# Altium schematic sheet C40_IMB_Block_Diagram_2.SchDoc: C40 IMB BLOCK DIAGRAM 2
size 812 x 571 mm; DocumentNumber: 3; SheetNumber: 2; SheetTotal: 7; PageSetup: Record=PageOptions|CenterHorizontal=True|CenterVertical=True|PrintScale=0.48|XCorrection=1.00|YCorrection=1.00|PrintKind=0|BorderSize=5000000|LeftOffset=0|BottomOffset=0|Orientation=2|PaperLength=1000|PaperWidth=1000|Scale=100|PaperSource=15|PrintQuality=1200|MediaType=1|DitherType=10|PaperKind=11 x 17|PrintScaleMode=1
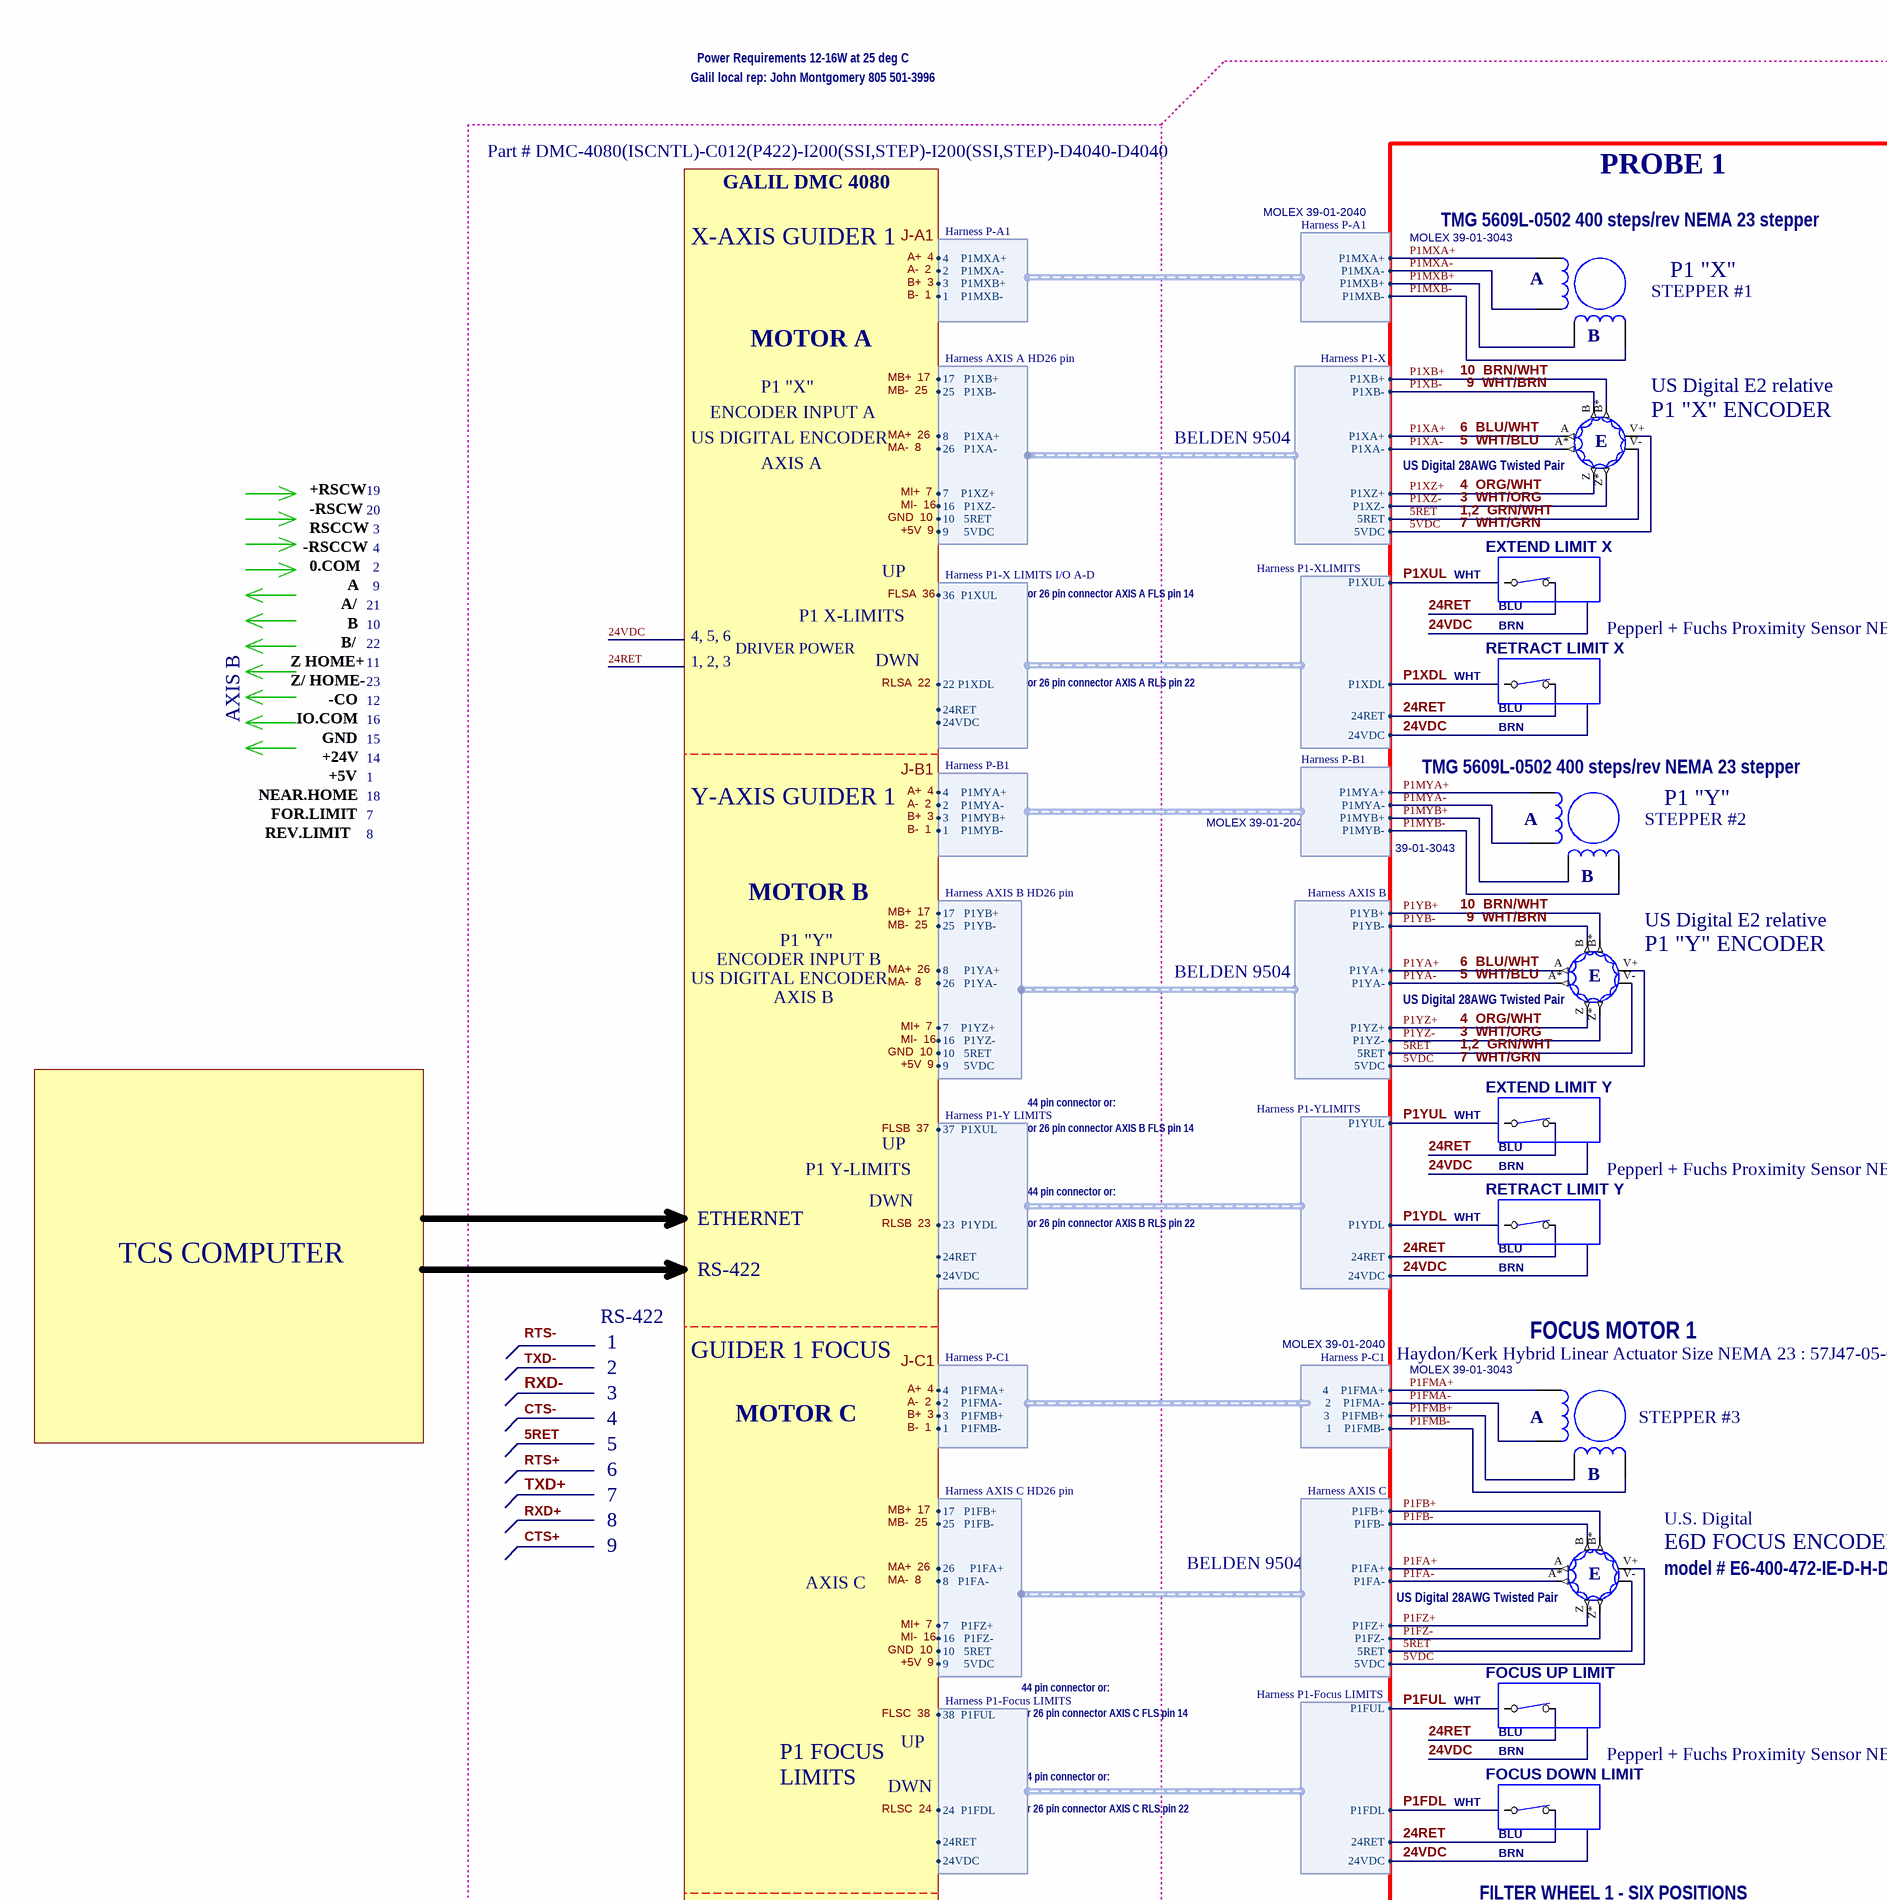
[diagram p0: C40_IMB_Block_Diagram_2.SchDoc, top left]
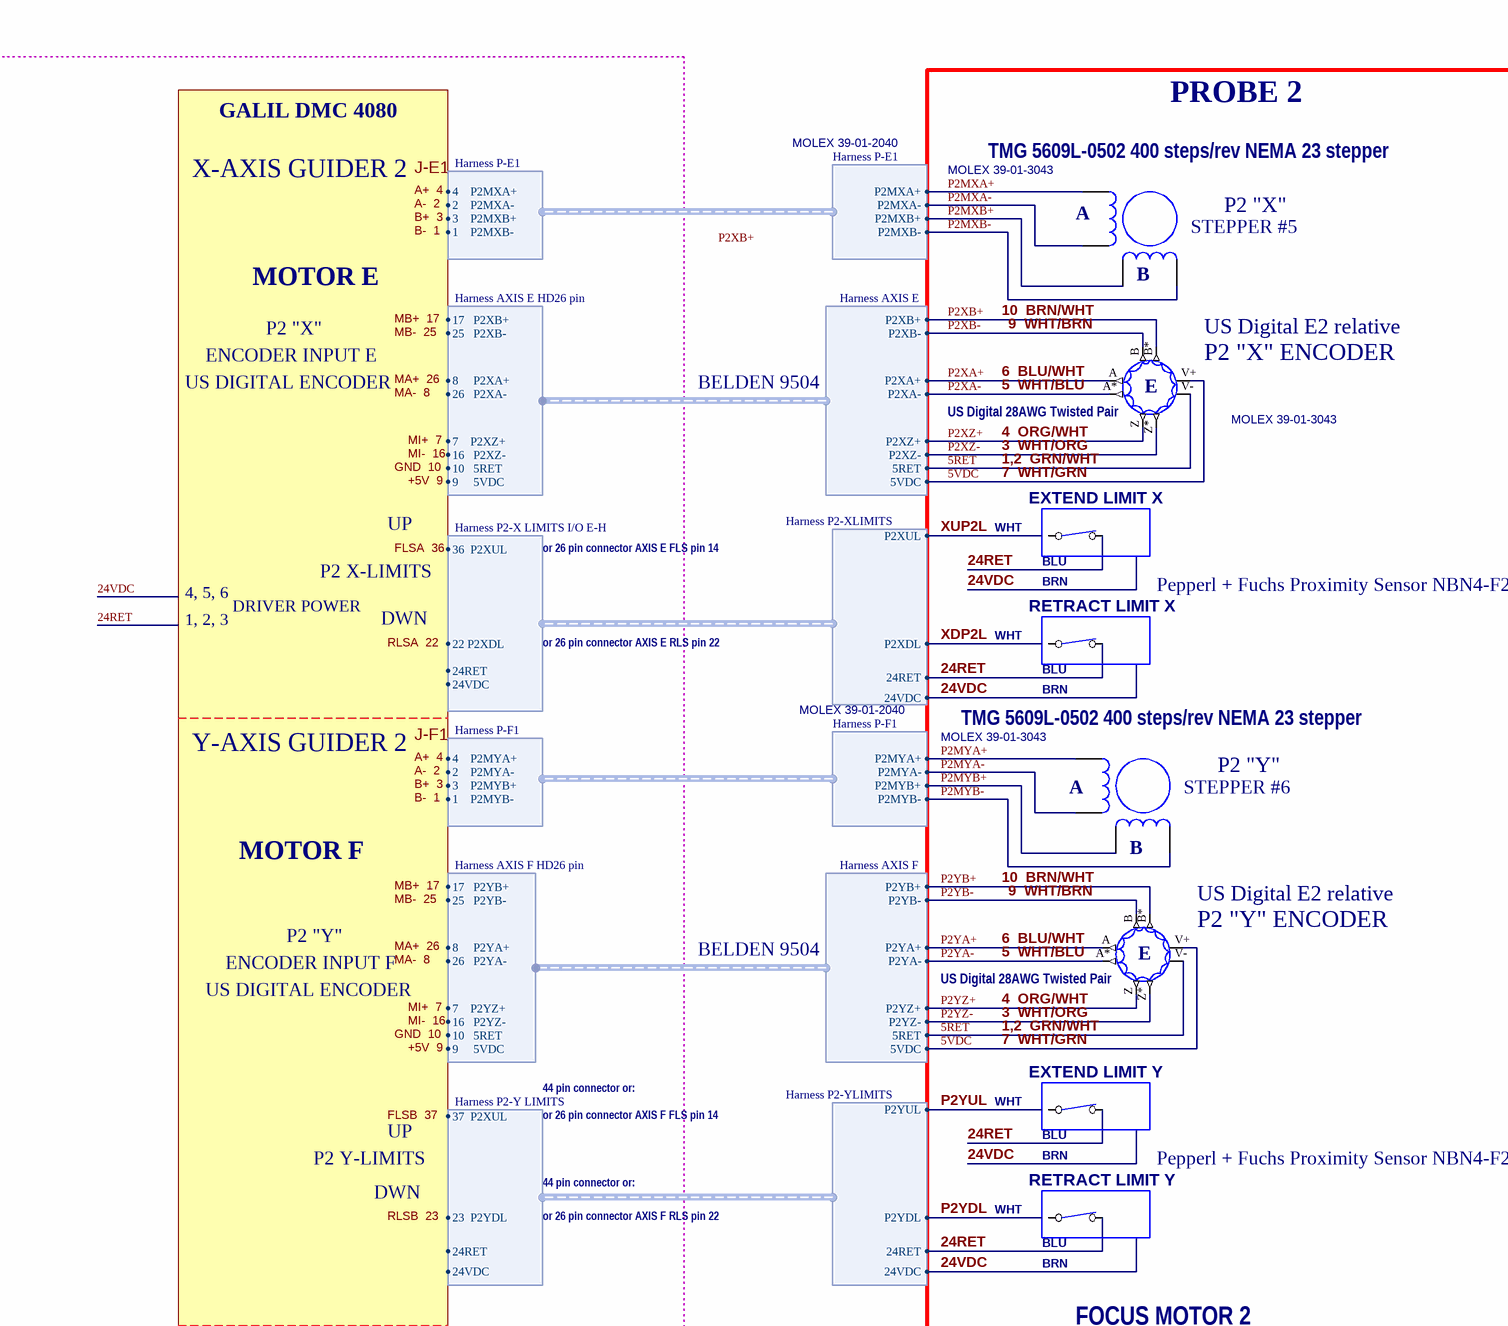
[diagram p1: C40_IMB_Block_Diagram_2.SchDoc, top middle]
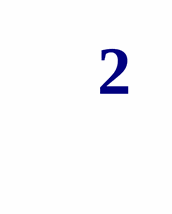
[diagram p2: C40_IMB_Block_Diagram_2.SchDoc, top right]
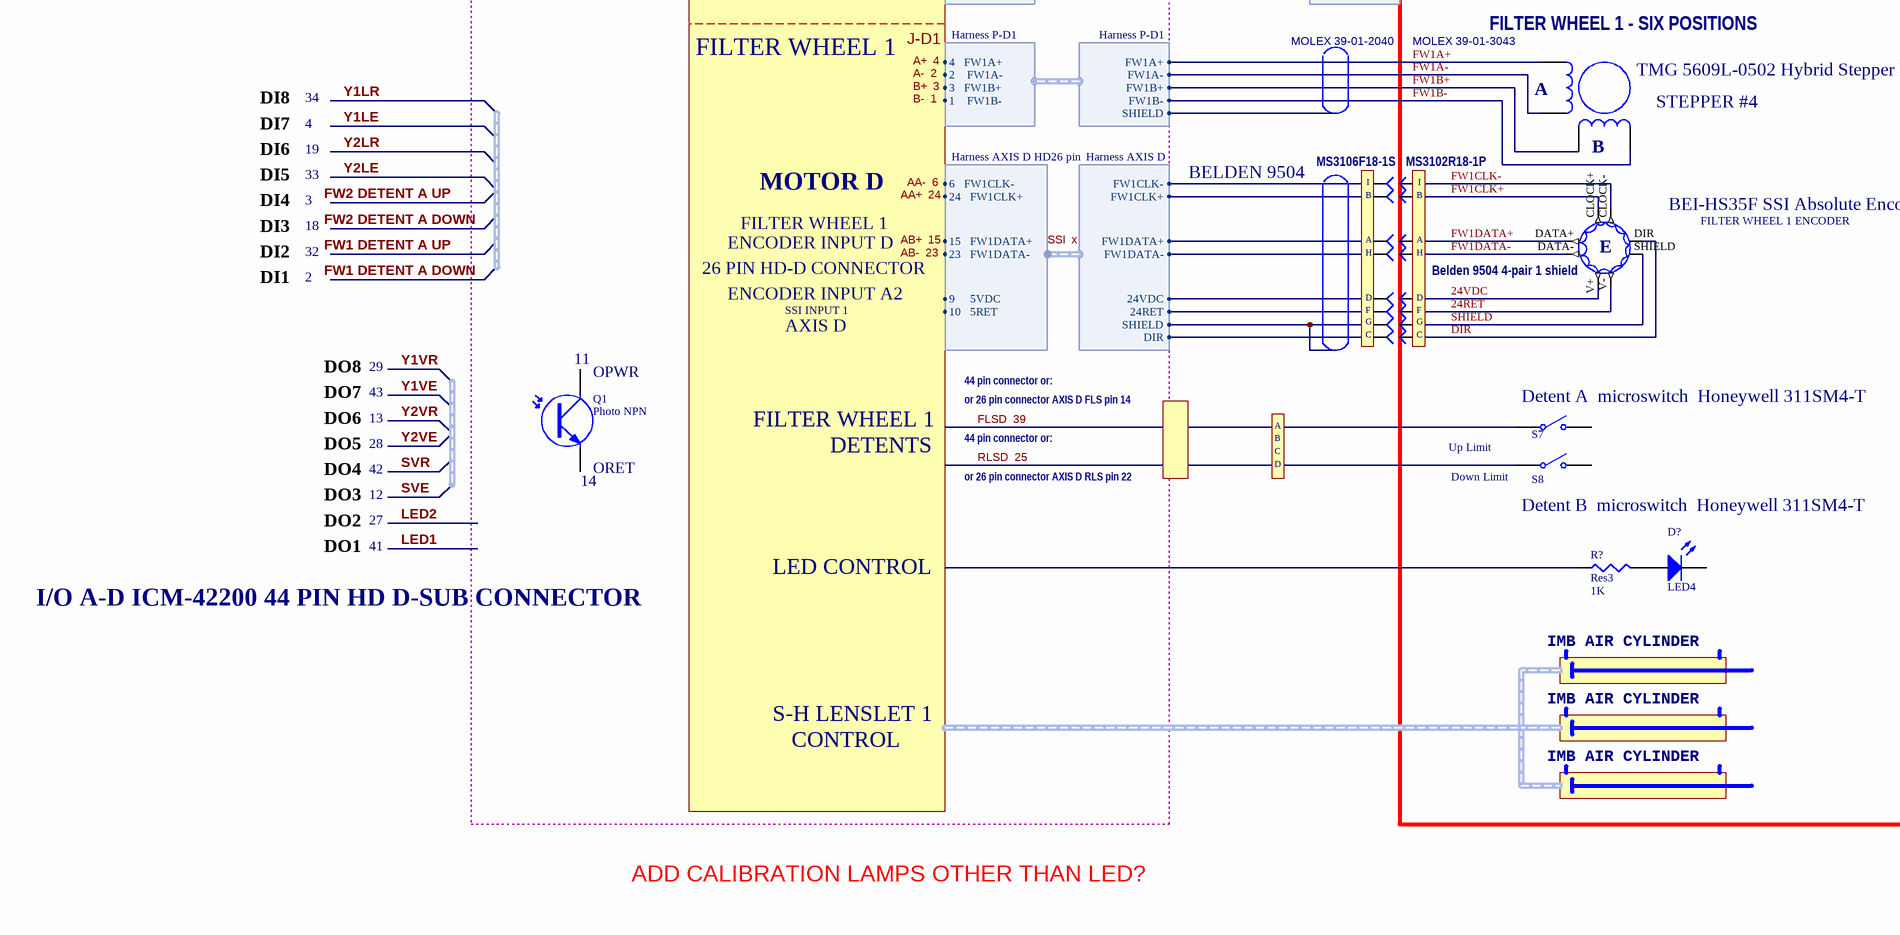
[diagram p3: C40_IMB_Block_Diagram_2.SchDoc, bottom left]
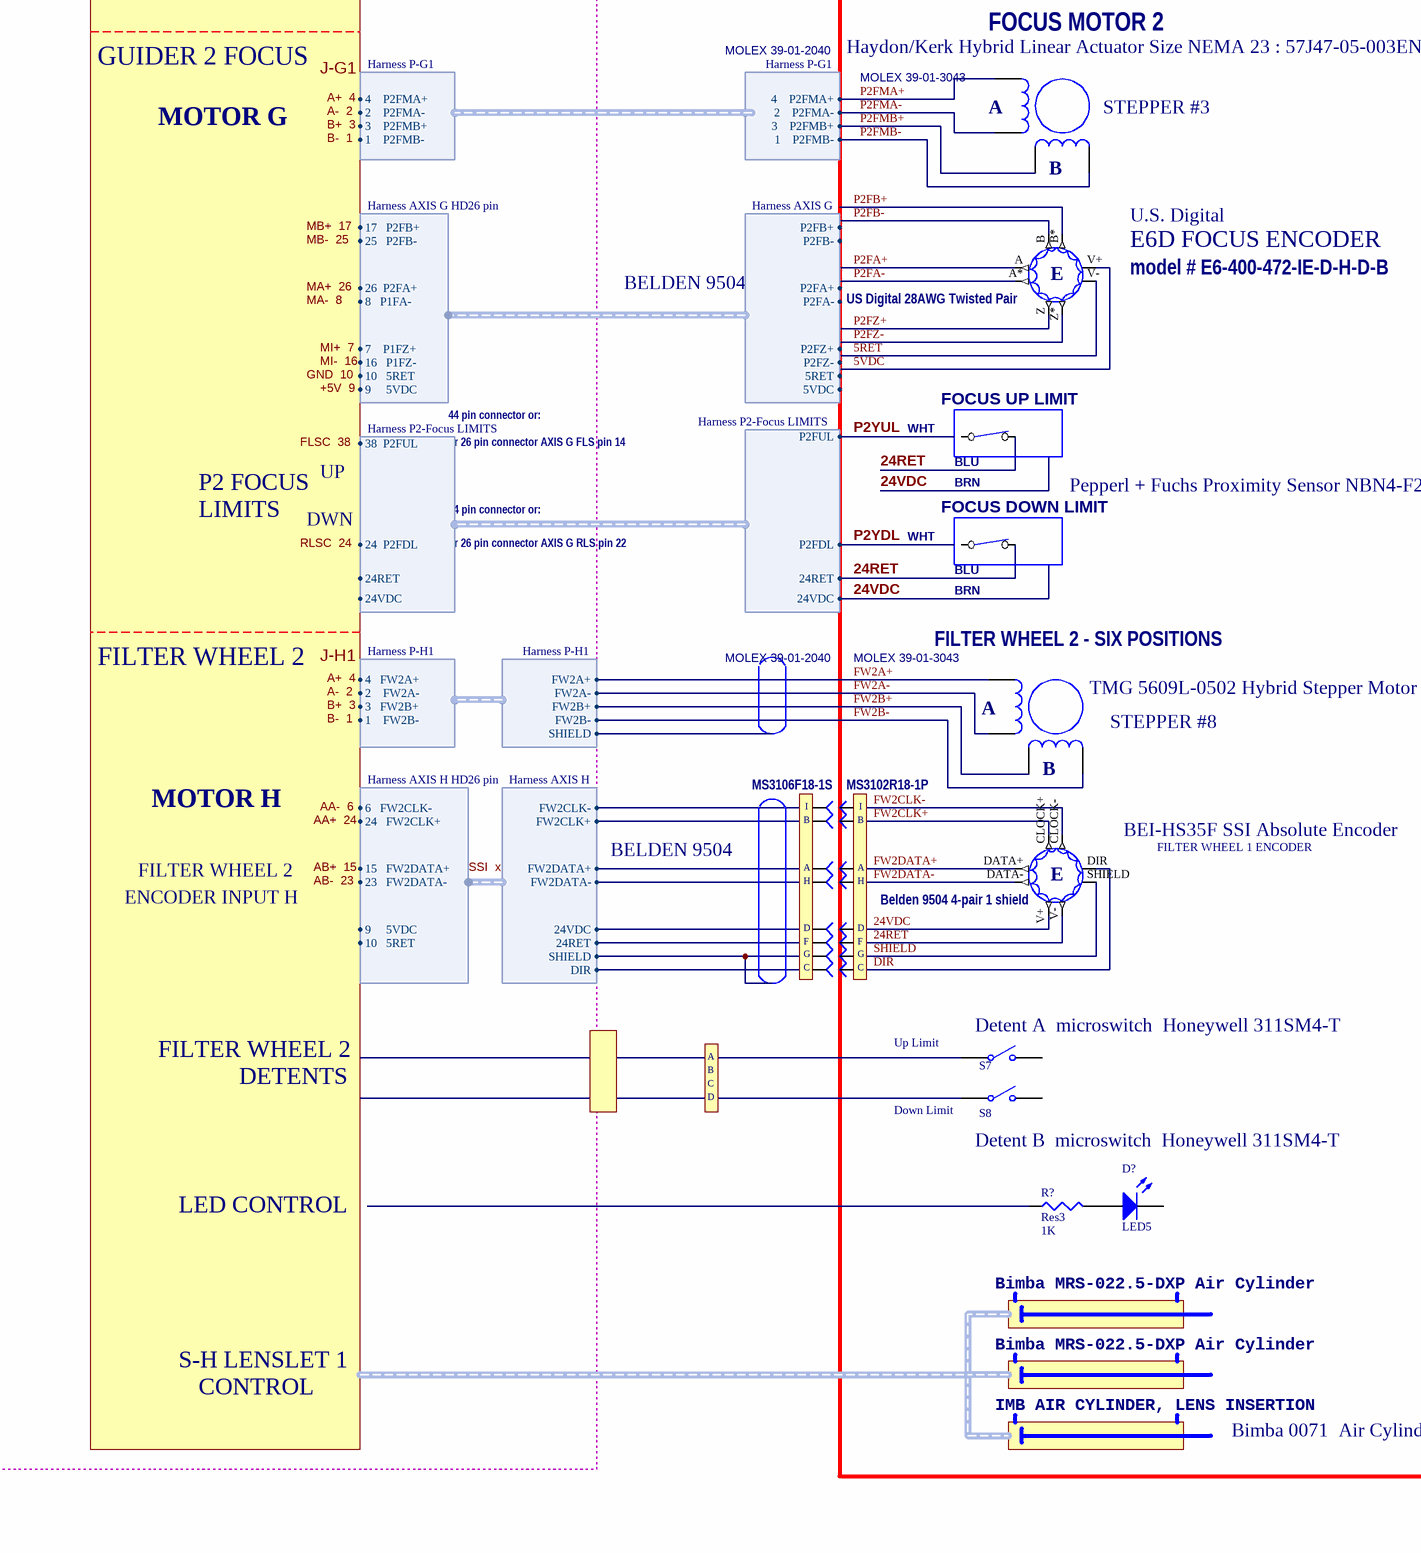
[diagram p4: C40_IMB_Block_Diagram_2.SchDoc, bottom middle]
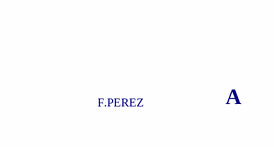
[diagram p5: C40_IMB_Block_Diagram_2.SchDoc, bottom right]

## Parts
(Parts that share a designator on the sheet are numbered #1, #2 ... from top to bottom, then left to right.)
?#1  SW-NC2  (value not drawn)
?#2  SW-NC2  (value not drawn)
?#3  SW-NC2  (value not drawn)
?#4  SW-NC2  (value not drawn)
?#5  SW-NC2  (value not drawn)
?#6  SW-NC2  (value not drawn)
?#7  SW-NC2  (value not drawn)
?#8  SW-NC2  (value not drawn)
?#9  SW-NC2  (value not drawn)
?#10  SW-NC2  (value not drawn)
?#11  SW-NC2  (value not drawn)
?#12  SW-NC2  (value not drawn)
?#13  (no value)
?#14  (no value)
?#15  (no value)
?#16  (no value)
?#17  (no value)
?#18  (no value)
?#19  (no value)
?#20  (no value)
?#21  (no value)
?#22  (no value)
?#23  (no value)
?#24  (no value)
?#25  (no value)
?#26  (no value)
?#27  (no value)
?#28  (no value)
B#1  (no value)
B#2  (no value)
B#3  (no value)
B#4  (no value)
B#5  (no value)
B#6  (no value)
B#7  (no value)
B#8  (no value)
B#9  (no value)
B#10  (no value)
B#11  (no value)
B#12  (no value)
B#13  (no value)
B#14  (no value)
B#15  (no value)
B#16  (no value)
BEI-HS35F_SSI_Absolute_Encoder#1  FILTER WHEEL 1 ENCODER
BEI-HS35F_SSI_Absolute_Encoder#2  FILTER WHEEL 1 ENCODER
Bimba_MRS-022.5-DXP_Air_Cylinder#1  (no value)
Bimba_MRS-022.5-DXP_Air_Cylinder#2  (no value)
D?#1  LED4  [LED-1]
D?#2  LED5  [LED-1]
Haydon/Kerk_Hybrid_Linear_Actuator_Size_NEMA_23_:_57J47-05-003ENG#1  STEPPER #3
Haydon/Kerk_Hybrid_Linear_Actuator_Size_NEMA_23_:_57J47-05-003ENG#2  STEPPER #3
IMB_AIR_CYLINDER#1  (no value)
IMB_AIR_CYLINDER#2  (no value)
IMB_AIR_CYLINDER#3  (no value)
IMB_AIR_CYLINDER,_LENS_INSERTION  (no value)
P1_"X"  STEPPER #1
P1_"Y"  STEPPER #2
P2_"X"  STEPPER #5
P2_"Y"  STEPPER #6
Q1  Photo NPN  [SFM-T2(3)/X1.6V]
R?#1  Res3  value 1K  [J1-0603]
R?#2  Res3  value 1K  [J1-0603]
S7#1  Up Limit  [SPST-2]
S7#2  Up Limit  [SPST-2]
S8#1  Down Limit  [SPST-2]
S8#2  Down Limit  [SPST-2]
TMG_5609L-0502_Hybrid_Stepper_Motor#1  STEPPER #4
TMG_5609L-0502_Hybrid_Stepper_Motor#2  STEPPER #8
U.S._Digital#1  E6D FOCUS ENCODER
U.S._Digital#2  E6D FOCUS ENCODER
US_Digital_E2_relative#1  P1 "X" ENCODER
US_Digital_E2_relative#2  P2 "X" ENCODER
US_Digital_E2_relative#3  P1 "Y" ENCODER
US_Digital_E2_relative#4  P2 "Y" ENCODER

## Blocks framed on the sheet
PROBE 1: ?#1 ?#3 ?#5 ?#7 ?#9 ?#11 B#1 B#3 B#5 B#7 B#9 B#11 B#13 B#15 BEI-HS35F_SSI_Absolute_Encoder#1 D?#1 Haydon/Kerk_Hybrid_Linear_Actuator_Size_NEMA_23_:_57J47-05-003ENG#2 IMB_AIR_CYLINDER#1-IMB_AIR_CYLINDER#3 P1_"X" P1_"Y" R?#1 S7#1 S8#1 TMG_5609L-0502_Hybrid_Stepper_Motor#1 U.S._Digital#2 US_Digital_E2_relative#1 US_Digital_E2_relative#3
PROBE 2: ?#2 ?#4 ?#6 ?#8 ?#10 ?#12 B#2 B#4 B#6 B#8 B#10 B#12 B#14 B#16 BEI-HS35F_SSI_Absolute_Encoder#2 Bimba_MRS-022.5-DXP_Air_Cylinder#1 Bimba_MRS-022.5-DXP_Air_Cylinder#2 D?#2 Haydon/Kerk_Hybrid_Linear_Actuator_Size_NEMA_23_:_57J47-05-003ENG#1 IMB_AIR_CYLINDER,_LENS_INSERTION P2_"X" P2_"Y" R?#2 S7#2 S8#2 TMG_5609L-0502_Hybrid_Stepper_Motor#2 U.S._Digital#1 US_Digital_E2_relative#2 US_Digital_E2_relative#4

## Harnesses
Harness P1-X: P1XB+, P1XB-, P1XA+, P1XA-, P1XZ+, P1XZ-, 5RET, 5VDC
Harness AXIS D: FW1CLK-, FW1CLK+, FW1DATA+, FW1DATA-, 24VDC, 24RET, SHIELD, DIR
Harness AXIS A HD26 pin: 17   P1XB+, 25   P1XB-, 8     P1XA+, 26   P1XA-, 7    P1XZ+, 16   P1XZ-, 10   5RET, 9     5VDC
Harness AXIS B: P1YB+, P1YB-, P1YA+, P1YA-, P1YZ+, P1YZ-, 5RET, 5VDC
Harness AXIS B HD26 pin: 17   P1YB+, 25   P1YB-, 8     P1YA+, 26   P1YA-, 7    P1YZ+, 16   P1YZ-, 10   5RET, 9     5VDC
Harness AXIS C: P1FB+, P1FB-, P1FA+, P1FA-, P1FZ+, P1FZ-, 5RET, 5VDC
Harness AXIS C HD26 pin: 17   P1FB+, 25   P1FB-, 26     P1FA+, 8   P1FA-, 7    P1FZ+, 16   P1FZ-, 10   5RET, 9     5VDC
Harness P1-XLIMITS: P1XUL, 24RET, 24VDC, P1XDL
Harness P1-X LIMITS I/O A-D: 36  P1XUL, 24RET, 24VDC, 22 P1XDL
Harness P1-YLIMITS: P1YUL, 24RET, 24VDC, P1YDL
Harness P1-Y LIMITS: 37  P1XUL, 24RET, 24VDC, 23  P1YDL
Harness P1-Focus LIMITS: P1FUL, 24RET, 24VDC, P1FDL
Harness P1-Focus LIMITS: 38  P1FUL, 24RET, 24VDC, 24  P1FDL
Harness AXIS D HD26 pin: 10   5RET, 9     5VDC, 6   FW1CLK-, 24   FW1CLK+, 15   FW1DATA+, 23   FW1DATA-
Harness P-C1: 4    P1FMA+, 2    P1FMA-, 3    P1FMB+, 1    P1FMB-
Harness P-B1: 4    P1MYA+, 2    P1MYA-, 3    P1MYB+, 1    P1MYB-
Harness P-B1: P1MYA+, P1MYA-, P1MYB+, P1MYB-
Harness P-A1: 4    P1MXA+, 2    P1MXA-, 3    P1MXB+, 1    P1MXB-
Harness P-A1: P1MXA+, P1MXA-, P1MXB+, P1MXB-
Harness P-D1: 4   FW1A+, 2    FW1A-, 3   FW1B+, 1    FW1B-
Harness P-D1: FW1A+, FW1A-, FW1B+, FW1B-, SHIELD
Harness AXIS E: P2XB+, P2XB-, P2XA+, P2XA-, P2XZ+, P2XZ-, 5RET, 5VDC
Harness AXIS E HD26 pin: 17   P2XB+, 25   P2XB-, 8     P2XA+, 26   P2XA-, 7    P2XZ+, 16   P2XZ-, 10   5RET, 9     5VDC
Harness AXIS F: P2YB+, P2YB-, P2YA+, P2YA-, P2YZ+, P2YZ-, 5RET, 5VDC
Harness AXIS F HD26 pin: 17   P2YB+, 25   P2YB-, 8     P2YA+, 26   P2YA-, 7    P2YZ+, 16   P2YZ-, 10   5RET, 9     5VDC
Harness AXIS G: P2FB+, P2FB-, P2FA+, P2FA-, P2FZ+, P2FZ-, 5RET, 5VDC
Harness AXIS G HD26 pin: 17   P2FB+, 25   P2FB-, 26  P2FA+, 8   P1FA-, 7    P1FZ+, 16   P1FZ-, 10   5RET, 9     5VDC
Harness P2-XLIMITS: P2XUL, 24RET, 24VDC, P2XDL
Harness P2-X LIMITS I/O E-H: 36  P2XUL, 24RET, 24VDC, 22 P2XDL
Harness P2-YLIMITS: P2YUL, 24RET, 24VDC, P2YDL
Harness P2-Y LIMITS: 37  P2XUL, 24RET, 24VDC, 23  P2YDL
Harness P2-Focus LIMITS: P2FUL, 24RET, 24VDC, P2FDL
Harness P2-Focus LIMITS: 38  P2FUL, 24RET, 24VDC, 24  P2FDL
Harness P-G1: 4    P2FMA+, 2    P2FMA-, 3    P2FMB+, 1    P2FMB-
Harness P-F1: 4    P2MYA+, 2    P2MYA-, 3    P2MYB+, 1    P2MYB-
Harness P-F1: P2MYA+, P2MYA-, P2MYB+, P2MYB-
Harness P-E1: 4    P2MXA+, 2    P2MXA-, 3    P2MXB+, 1    P2MXB-
Harness P-E1: P2MXA+, P2MXA-, P2MXB+, P2MXB-
Harness AXIS H: FW2CLK-, FW2CLK+, FW2DATA+, FW2DATA-, 24VDC, 24RET, SHIELD, DIR
Harness AXIS H HD26 pin: 10   5RET, 9     5VDC, 6   FW2CLK-, 24   FW2CLK+, 15   FW2DATA+, 23   FW2DATA-
Harness P-H1: 4   FW2A+, 2    FW2A-, 3   FW2B+, 1    FW2B-
Harness P-H1: FW2A+, FW2A-, FW2B+, FW2B-, SHIELD

## Nets
1,2  GRN/WHT: U.S._Digital#1.V- U.S._Digital#2.V- US_Digital_E2_relative#1.V- US_Digital_E2_relative#2.V- US_Digital_E2_relative#3.V- US_Digital_E2_relative#4.V- ; harness Harness P1-X.5RET, harness Harness AXIS B.5RET, harness Harness AXIS C.5RET, harness Harness AXIS E.5RET, harness Harness AXIS F.5RET  [also labelled 5RET]
3  WHT/ORG: US_Digital_E2_relative#1.Z* US_Digital_E2_relative#2.Z* US_Digital_E2_relative#3.Z* US_Digital_E2_relative#4.Z* ; harness Harness P1-X.P1XZ-, harness Harness AXIS B.P1YZ-, harness Harness AXIS E.P2XZ-, harness Harness AXIS F.P2YZ-  [also labelled P1XZ-, P1YZ-, P2XZ-, P2YZ-]
4  ORG/WHT: US_Digital_E2_relative#1.Z US_Digital_E2_relative#2.Z US_Digital_E2_relative#3.Z US_Digital_E2_relative#4.Z ; harness Harness P1-X.P1XZ+, harness Harness AXIS B.P1YZ+, harness Harness AXIS E.P2XZ+, harness Harness AXIS F.P2YZ+  [also labelled P1XZ+, P1YZ+, P2XZ+, P2YZ+]
5  WHT/BLU: US_Digital_E2_relative#1.A* US_Digital_E2_relative#2.A* US_Digital_E2_relative#3.A* US_Digital_E2_relative#4.A* ; harness Harness P1-X.P1XA-, harness Harness AXIS B.P1YA-, harness Harness AXIS E.P2XA-, harness Harness AXIS F.P2YA-  [also labelled P1XA-, P1YA-, P2XA-, P2YA-]
5VDC: U.S._Digital#1.V+ U.S._Digital#2.V+ US_Digital_E2_relative#1.V+ US_Digital_E2_relative#2.V+ US_Digital_E2_relative#3.V+ US_Digital_E2_relative#4.V+ ; harness Harness P1-X.5VDC, harness Harness AXIS B.5VDC, harness Harness AXIS C.5VDC, harness Harness AXIS E.5VDC, harness Harness AXIS F.5VDC  [also labelled 7  WHT/GRN]
6  BLU/WHT: US_Digital_E2_relative#1.A US_Digital_E2_relative#2.A US_Digital_E2_relative#3.A US_Digital_E2_relative#4.A ; harness Harness P1-X.P1XA+, harness Harness AXIS B.P1YA+, harness Harness AXIS E.P2XA+, harness Harness AXIS F.P2YA+  [also labelled P1XA+, P1YA+, P2XA+, P2YA+]
9  WHT/BRN: US_Digital_E2_relative#1.B US_Digital_E2_relative#2.B US_Digital_E2_relative#3.B US_Digital_E2_relative#4.B ; harness Harness P1-X.P1XB-, harness Harness AXIS B.P1YB-, harness Harness AXIS E.P2XB-, harness Harness AXIS F.P2YB-  [also labelled P1XB-, P1YB-, P2XB-, P2YB-]
10  BRN/WHT: US_Digital_E2_relative#1.B* US_Digital_E2_relative#2.B* US_Digital_E2_relative#3.B* US_Digital_E2_relative#4.B* ; harness Harness P1-X.P1XB+, harness Harness AXIS B.P1YB+, harness Harness AXIS E.P2XB+, harness Harness AXIS F.P2YB+  [also labelled P1XB+, P1YB+, P2XB+, P2YB+]
24RET: ?#1.2 ?#2.2 ?#3.2 ?#4.2 ?#5.2 ?#6.2 ?#7.2 ?#8.2 ?#9.2 ?#10.2 ?#11.2 ?#12.2 B#11.?1 B#12.?1 BEI-HS35F_SSI_Absolute_Encoder#1.V- BEI-HS35F_SSI_Absolute_Encoder#2.V- ; harness Harness P1-XLIMITS.24RET, harness Harness P1-X LIMITS I/O A-D.24RET, harness Harness P1-YLIMITS.24RET, harness Harness P1-Y LIMITS.24RET, harness Harness P1-Focus LIMITS.24RET, harness Harness P2-XLIMITS.24RET, harness Harness P2-X LIMITS I/O E-H.24RET, harness Harness P2-YLIMITS.24RET, harness Harness P2-Y LIMITS.24RET, harness Harness P2-Focus LIMITS.24RET
24VDC: B#9.?1 B#10.?1 BEI-HS35F_SSI_Absolute_Encoder#1.V+ BEI-HS35F_SSI_Absolute_Encoder#2.V+ ; harness Harness P1-XLIMITS.24VDC, harness Harness P1-X LIMITS I/O A-D.24VDC, harness Harness P1-YLIMITS.24VDC, harness Harness P1-Y LIMITS.24VDC, harness Harness P1-Focus LIMITS.24VDC, harness Harness P2-XLIMITS.24VDC, harness Harness P2-X LIMITS I/O E-H.24VDC, harness Harness P2-YLIMITS.24VDC, harness Harness P2-Y LIMITS.24VDC, harness Harness P2-Focus LIMITS.24VDC
DIR: B#15.?1 B#16.?1 BEI-HS35F_SSI_Absolute_Encoder#1.DIR BEI-HS35F_SSI_Absolute_Encoder#2.DIR
FLSD  39: S7#1.1(COMMON)
FW1A+: TMG_5609L-0502_Hybrid_Stepper_Motor#1.1 ; harness Harness P-D1.FW1A+
FW1A-: TMG_5609L-0502_Hybrid_Stepper_Motor#1.3 ; harness Harness P-D1.FW1A-
FW1B+: TMG_5609L-0502_Hybrid_Stepper_Motor#1.4 ; harness Harness P-D1.FW1B+
FW1B-: TMG_5609L-0502_Hybrid_Stepper_Motor#1.6 ; harness Harness P-D1.FW1B-
FW1CLK+: B#3.?1 BEI-HS35F_SSI_Absolute_Encoder#1.CLOCK+
FW1CLK-: BEI-HS35F_SSI_Absolute_Encoder#1.CLOCK-
FW1DATA+: B#5.?1 BEI-HS35F_SSI_Absolute_Encoder#1.DATA+
FW1DATA-: B#7.?1 BEI-HS35F_SSI_Absolute_Encoder#1.DATA-
FW2A+: TMG_5609L-0502_Hybrid_Stepper_Motor#2.1 ; harness Harness P-H1.FW2A+
FW2A-: TMG_5609L-0502_Hybrid_Stepper_Motor#2.3 ; harness Harness P-H1.FW2A-
FW2B+: TMG_5609L-0502_Hybrid_Stepper_Motor#2.4 ; harness Harness P-H1.FW2B+
FW2B-: TMG_5609L-0502_Hybrid_Stepper_Motor#2.6 ; harness Harness P-H1.FW2B-
FW2CLK+: B#4.?1 BEI-HS35F_SSI_Absolute_Encoder#2.CLOCK+
FW2CLK-: BEI-HS35F_SSI_Absolute_Encoder#2.CLOCK-
FW2DATA+: B#6.?1 BEI-HS35F_SSI_Absolute_Encoder#2.DATA+
FW2DATA-: B#8.?1 BEI-HS35F_SSI_Absolute_Encoder#2.DATA-
P1FA+: U.S._Digital#2.A ; harness Harness AXIS C.P1FA+
P1FA-: U.S._Digital#2.A* ; harness Harness AXIS C.P1FA-
P1FB+: U.S._Digital#2.B* ; harness Harness AXIS C.P1FB+
P1FB-: U.S._Digital#2.B ; harness Harness AXIS C.P1FB-
P1FDL: harness Harness P1-Focus LIMITS.P1FDL
P1FMA+: Haydon/Kerk_Hybrid_Linear_Actuator_Size_NEMA_23_:_57J47-05-003ENG#2.1 ; harness Harness P-C1.4    P1FMA+
P1FMA-: Haydon/Kerk_Hybrid_Linear_Actuator_Size_NEMA_23_:_57J47-05-003ENG#2.3 ; harness Harness P-C1.2    P1FMA-
P1FMB+: Haydon/Kerk_Hybrid_Linear_Actuator_Size_NEMA_23_:_57J47-05-003ENG#2.4 ; harness Harness P-C1.3    P1FMB+
P1FMB-: Haydon/Kerk_Hybrid_Linear_Actuator_Size_NEMA_23_:_57J47-05-003ENG#2.6 ; harness Harness P-C1.1    P1FMB-
P1FUL: harness Harness P1-Focus LIMITS.P1FUL
P1FZ+: U.S._Digital#2.Z ; harness Harness AXIS C.P1FZ+
P1FZ-: U.S._Digital#2.Z* ; harness Harness AXIS C.P1FZ-
P1MXA+: P1_"X".1 ; harness Harness P-A1.P1MXA+
P1MXA-: P1_"X".3 ; harness Harness P-A1.P1MXA-
P1MXB+: P1_"X".4 ; harness Harness P-A1.P1MXB+
P1MXB-: P1_"X".6 ; harness Harness P-A1.P1MXB-
P1MYA+: P1_"Y".1 ; harness Harness P-B1.P1MYA+
P1MYA-: P1_"Y".3 ; harness Harness P-B1.P1MYA-
P1MYB+: P1_"Y".4 ; harness Harness P-B1.P1MYB+
P1MYB-: P1_"Y".6 ; harness Harness P-B1.P1MYB-
P1XDL: harness Harness P1-XLIMITS.P1XDL
P1XUL: harness Harness P1-XLIMITS.P1XUL
P1YDL: harness Harness P1-YLIMITS.P1YDL
P1YUL: harness Harness P1-YLIMITS.P1YUL
P2FA+: U.S._Digital#1.A
P2FA-: U.S._Digital#1.A*
P2FB+: U.S._Digital#1.B*
P2FB-: U.S._Digital#1.B
P2FMA+: Haydon/Kerk_Hybrid_Linear_Actuator_Size_NEMA_23_:_57J47-05-003ENG#1.1 ; harness Harness P-G1.4    P2FMA+
P2FMA-: Haydon/Kerk_Hybrid_Linear_Actuator_Size_NEMA_23_:_57J47-05-003ENG#1.3 ; harness Harness P-G1.2    P2FMA-
P2FMB+: Haydon/Kerk_Hybrid_Linear_Actuator_Size_NEMA_23_:_57J47-05-003ENG#1.4 ; harness Harness P-G1.3    P2FMB+
P2FMB-: Haydon/Kerk_Hybrid_Linear_Actuator_Size_NEMA_23_:_57J47-05-003ENG#1.6 ; harness Harness P-G1.1    P2FMB-
P2FZ+: U.S._Digital#1.Z
P2FZ-: U.S._Digital#1.Z*
P2MXA+: P2_"X".1 ; harness Harness P-E1.P2MXA+
P2MXA-: P2_"X".3 ; harness Harness P-E1.P2MXA-
P2MXB+: P2_"X".4 ; harness Harness P-E1.P2MXB+
P2MXB-: P2_"X".6 ; harness Harness P-E1.P2MXB-
P2MYA+: P2_"Y".1 ; harness Harness P-F1.P2MYA+
P2MYA-: P2_"Y".3 ; harness Harness P-F1.P2MYA-
P2MYB+: P2_"Y".4 ; harness Harness P-F1.P2MYB+
P2MYB-: P2_"Y".6 ; harness Harness P-F1.P2MYB-
P2YDL: harness Harness P2-YLIMITS.P2YDL, harness Harness P2-Focus LIMITS.P2FDL
P2YUL: harness Harness P2-YLIMITS.P2YUL, harness Harness P2-Focus LIMITS.P2FUL
RLSD  25: S8#1.1(COMMON)
SHIELD: B#13.?1 B#14.?1 BEI-HS35F_SSI_Absolute_Encoder#1.SHIELD BEI-HS35F_SSI_Absolute_Encoder#2.SHIELD
XDP2L: harness Harness P2-XLIMITS.P2XDL
XUP2L: harness Harness P2-XLIMITS.P2XUL
NetD?#1_1: D?#1.1(A) R?#1.2
NetD?#2_1: D?#2.1(A) R?#2.2

Not connected (* = marked no-connect by the designer): ?#1 1; ?#2 1; ?#3 1; ?#4 1; ?#5 1; ?#6 1; ?#7 1; ?#8 1; ?#9 1; ?#10 1; ?#11 1; ?#12 1; ?#13 ?1; ?#14 ?1; ?#15 ?1; ?#16 ?1; ?#17 ?1; ?#18 ?1; ?#19 ?1; ?#20 ?1; ?#21 ?1; ?#22 ?1; ?#23 ?1; ?#24 ?1; ?#25 ?1; ?#26 ?1; ?#27 ?1; ?#28 ?1; B#1 ?1; B#2 ?1; D?#1 2(K); D?#2 2(K); Q1 1(C) 3(E); R?#1 1; R?#2 1; S7#1 2(NO); S7#2 1(COMMON) 2(NO); S8#1 2(NO); S8#2 1(COMMON) 2(NO)

## Notes on the sheet
- Power Requirements 12-16W at 25 deg C
- Full hardware handshaking required for Galil controller
- Galil local rep: John Montgomery 805 501-3996
- 2
- Part # DMC-4080(ISCNTL)-C012(P422)-I200(SSI,STEP)-I200(SSI,STEP)-D4040-D4040
- GALIL DMC 4080
- X-AXIS GUIDER 1
- MOLEX 39-01-2040
- MOLEX 39-01-3043
- (near P1_"X") TMG 5609L-0502 400 steps/rev NEMA 23 stepper
- X-AXIS GUIDER 2
- (near P2_"X") TMG 5609L-0502 400 steps/rev NEMA 23 stepper
- (near P1_"X") A
- (near P2_"X") A
- MOTOR A
- (near P1_"X") B
- MOTOR E
- (near P2_"X") B
- US DIGITAL ENCODER
- ENCODER INPUT A
- P1 "X"
- BELDEN 9504
- ENCODER INPUT E
- P2 "X"
- +RSCW
- 19
- AXIS A
- (near US_Digital_E2_relative#1) US Digital 28AWG Twisted Pair
- (near US_Digital_E2_relative#2) US Digital 28AWG Twisted Pair
- -RSCCW
- 0.COM
- RSCCW
- -RSCW
- 20
- 3
- 4
- EXTEND LIMIT X
- A/
- B
- A
- 21
- 10
- 9
- P1 X-LIMITS
- UP
- or 26 pin connector AXIS A FLS pin 14
- WHT
- BLU
- BRN
- P2 X-LIMITS
- or 26 pin connector AXIS E FLS pin 14
- Z/ HOME-
- Z HOME+
- B/
- 22
- 23
- 11
- 1, 2, 3
- 4, 5, 6
- DRIVER POWER
- DWN
- or 26 pin connector AXIS A RLS pin 22
- RETRACT LIMIT X
- Pepperl + Fuchs Proximity Sensor NBN4-F29-A0
- or 26 pin connector AXIS E RLS pin 22
- AXIS B
- IO.COM
- GND
- -CO
- 12
- 16
- 15
- NEAR.HOME
- FOR.LIMIT
- +24V
- +5V
- 1
- 14
- 18
- 7
- Y-AXIS GUIDER 1
- (near P1_"Y") TMG 5609L-0502 400 steps/rev NEMA 23 stepper
- (near P1_"Y") A
- Y-AXIS GUIDER 2
- (near P2_"Y") TMG 5609L-0502 400 steps/rev NEMA 23 stepper
- (near P2_"Y") A
- REV.LIMIT
- 8
- (near P1_"Y") B
- (near P2_"Y") B
- MOTOR B
- P1 "Y"
- MOTOR F
- ENCODER INPUT B
- (near US_Digital_E2_relative#3) US Digital 28AWG Twisted Pair
- ENCODER INPUT F
- P2 "Y"
- (near US_Digital_E2_relative#4) US Digital 28AWG Twisted Pair
- or 26 pin connector AXIS B FLS pin 14
- 44 pin connector or:
- EXTEND LIMIT Y
- or 26 pin connector AXIS F FLS pin 14
- P1 Y-LIMITS
- RETRACT LIMIT Y
- P2 Y-LIMITS
- TCS COMPUTER
- ETHERNET
- or 26 pin connector AXIS B RLS pin 22
- or 26 pin connector AXIS F RLS pin 22
- RS-422
- (near Haydon/Kerk_Hybrid_Linear_Actuator_Size_NEMA_23_:_57J47-05-003ENG#1) FOCUS MOTOR 2
- GUIDER 1 FOCUS
- (near Haydon/Kerk_Hybrid_Linear_Actuator_Size_NEMA_23_:_57J47-05-003ENG#2) FOCUS MOTOR 1
- GUIDER 2 FOCUS
- 5
- MOTOR C
- (near Haydon/Kerk_Hybrid_Linear_Actuator_Size_NEMA_23_:_57J47-05-003ENG#2) A
- MOTOR G
- (near Haydon/Kerk_Hybrid_Linear_Actuator_Size_NEMA_23_:_57J47-05-003ENG#1) A
- (near Haydon/Kerk_Hybrid_Linear_Actuator_Size_NEMA_23_:_57J47-05-003ENG#1) B
- 6
- (near Haydon/Kerk_Hybrid_Linear_Actuator_Size_NEMA_23_:_57J47-05-003ENG#2) B
- AXIS C
- (near U.S._Digital#2) model # E6-400-472-IE-D-H-D-B
- (near U.S._Digital#1) US Digital 28AWG Twisted Pair
- (near U.S._Digital#1) model # E6-400-472-IE-D-H-D-B
- (near U.S._Digital#2) US Digital 28AWG Twisted Pair
- or 26 pin connector AXIS C FLS pin 14
- FOCUS UP LIMIT
- or 26 pin connector AXIS G FLS pin 14
- P1 FOCUS
- P2 FOCUS
- LIMITS
- or 26 pin connector AXIS C RLS pin 22
- FOCUS DOWN LIMIT
- or 26 pin connector AXIS G RLS pin 22
- (near TMG_5609L-0502_Hybrid_Stepper_Motor#1) FILTER WHEEL 1 - SIX POSITIONS
- 34
- FILTER WHEEL 1
- (near TMG_5609L-0502_Hybrid_Stepper_Motor#1) A
- FILTER WHEEL 2
- (near TMG_5609L-0502_Hybrid_Stepper_Motor#2) FILTER WHEEL 2 - SIX POSITIONS
- (near TMG_5609L-0502_Hybrid_Stepper_Motor#2) A
- DI6
- DI7
- DI8
- (near TMG_5609L-0502_Hybrid_Stepper_Motor#1) B
- (near TMG_5609L-0502_Hybrid_Stepper_Motor#2) B
- DI4
- DI5
- 33
- MOTOR D
- (near B#1) MS3106F18-1S
- (near B#3) B
- (near B#1) I
- (near B#1) MS3102R18-1P
- MOTOR H
- (near B#2) MS3106F18-1S
- (near B#4) B
- (near B#2) I
- (near B#2) MS3102R18-1P
- DI1
- DI2
- DI3
- 32
- 26 PIN HD-D CONNECTOR
- ENCODER INPUT D
- (near B#5) A
- (near B#7) H
- (near BEI-HS35F_SSI_Absolute_Encoder#1) Belden 9504 4-pair 1 shield
- ENCODER INPUT H
- (near B#6) A
- (near B#8) H
- (near BEI-HS35F_SSI_Absolute_Encoder#2) Belden 9504 4-pair 1 shield
- ENCODER INPUT A2
- SSI INPUT 1
- AXIS D
- (near B#9) D
- (near B#15) C
- (near B#13) G
- (near B#11) F
- (near B#10) D
- (near B#16) C
- (near B#14) G
- (near B#12) F
- DO7
- DO8
- 43
- 29
- (near Q1) 11
- (near Q1) OPWR
- or 26 pin connector AXIS D FLS pin 14
- (near S7#1) Detent A  microswitch  Honeywell 311SM4-T
- (near S7#2) Detent A  microswitch  Honeywell 311SM4-T
- DO4
- DO5
- DO6
- 42
- 28
- 13
- (near Q1) 14
- (near Q1) ORET
- DETENTS
- or 26 pin connector AXIS D RLS pin 22
- D
- C
- DO2
- DO3
- 27
- (near S8#1) Detent B  microswitch  Honeywell 311SM4-T
- (near S8#2) Detent B  microswitch  Honeywell 311SM4-T
- I/O A-D ICM-42200 44 PIN HD D-SUB CONNECTOR
- DO1
- 41
- LED CONTROL
- S-H LENSLET 1
- CONTROL
- Bimba 0071  Air Cylinder
- ADD CALIBRATION LAMPS OTHER THAN LED?
- F.PEREZ
- Labels drawn without touching a wire or pin: +5V  9, A+  4, A-  2, AA+  24, AA-  6, AB+  15, AB-  23, B+  3, B-  1, CTS+, FLSA  36, FLSB  37, FLSC  38, FW1 DETENT A DOWN, FW1 DETENT A UP, FW2 DETENT A DOWN, FW2 DETENT A UP, GND  10, J-A1, J-B1, J-C1, J-D1, J-E1, J-F1, J-G1, J-H1, MA+  26, MA-  8, MB+  17, MB-  25, MI+  7, MI-  16, P2XB+, RLSA  22, RLSB  23, RLSC  24, RTS+, RTS-, SSI  x
- Carnegie Institution of Washington
- Pasadena, California 91101
- 813 Santa Barbara Street
- The Observatories
- PHONE (626) 577-1122               FAX (626) 795-8136
- Title:
- OCIW
- Size:
- Date:
- File:
- Scale:
- Drawn By:
- Checked By:
- A. BAGISH
- alanb
- Revision:
- Sheet          of
- (in symbol ENCODER DIF) E
- (in symbol ENCODER SSI) E

## Library data of the parts
?#13-?#28 = SOCKET-DMC
B#1-B#16 = PLUG-DMC
BEI-HS35F_SSI_Absolute_Encoder#1 BEI-HS35F_SSI_Absolute_Encoder#2 = ENCODER SSI
Bimba_MRS-022.5-DXP_Air_Cylinder#1 Bimba_MRS-022.5-DXP_Air_Cylinder#2 IMB_AIR_CYLINDER#1-IMB_AIR_CYLINDER#3 IMB_AIR_CYLINDER,_LENS_INSERTION = AIR CYL LONG IN
D?#1 D?#2 = LED1: Typical RED GaAs LED; Published: 8-Jun-2000; LatestRevisionDate: 08-Jul-2005; LatestRevisionNote: Mech Layer 1 removed.; PackageReference: LED-1; Publisher: Altium Limited; PackageDescription: LED; 2 Leads
Haydon/Kerk_Hybrid_Linear_Actuator_Size_NEMA_23_:_57J47-05-003ENG#1 Haydon/Kerk_Hybrid_Linear_Actuator_Size_NEMA_23_:_57J47-05-003ENG#2 P1_"X" P1_"Y" P2_"X" P2_"Y" TMG_5609L-0502_Hybrid_Stepper_Motor#1 TMG_5609L-0502_Hybrid_Stepper_Motor#2 = MOTOR STEPPER
Q1 = Photo NPN: NPN Phototransistor; Published: 24-Mar-1999; LatestRevisionDate: 17-Jul-2002; LatestRevisionNote: Re-released for DXP Platform.; PackageReference: TO-220_A; Publisher: Altium Limited; Code_JEDEC: TO-220-AC
R?#1 R?#2 = Res3: Resistor; Published: 8-Jun-2000; LatestRevisionDate: 29-May-2009; LatestRevisionNote: IPC-7351 Footprint Added.; PackageReference: J1-0603; Publisher: Altium Limited; PackageDescription: Chip Resistor
S7#1 S7#2 S8#1 S8#2 = SW-SPST: Single-Pole, Single-Throw Switch; Published: 24-Mar-1999; LatestRevisionDate: 17-Jul-2002; LatestRevisionNote: Re-released for DXP Platform.; Publisher: Altium Limited
U.S._Digital#1 U.S._Digital#2 US_Digital_E2_relative#1-US_Digital_E2_relative#4 = ENCODER DIF